# EasyEDA Pro project CanToUart.eprj

# Schematic Schematic1
Board Name: Board1; Create Date: 2025-09-19; Page Name: P1; Project Name: CanToUart; Schematic Name: Schematic1; Update Date: 2025-09-26; Company: 嘉立创EDA; Page Size: A4; Version: V1.0
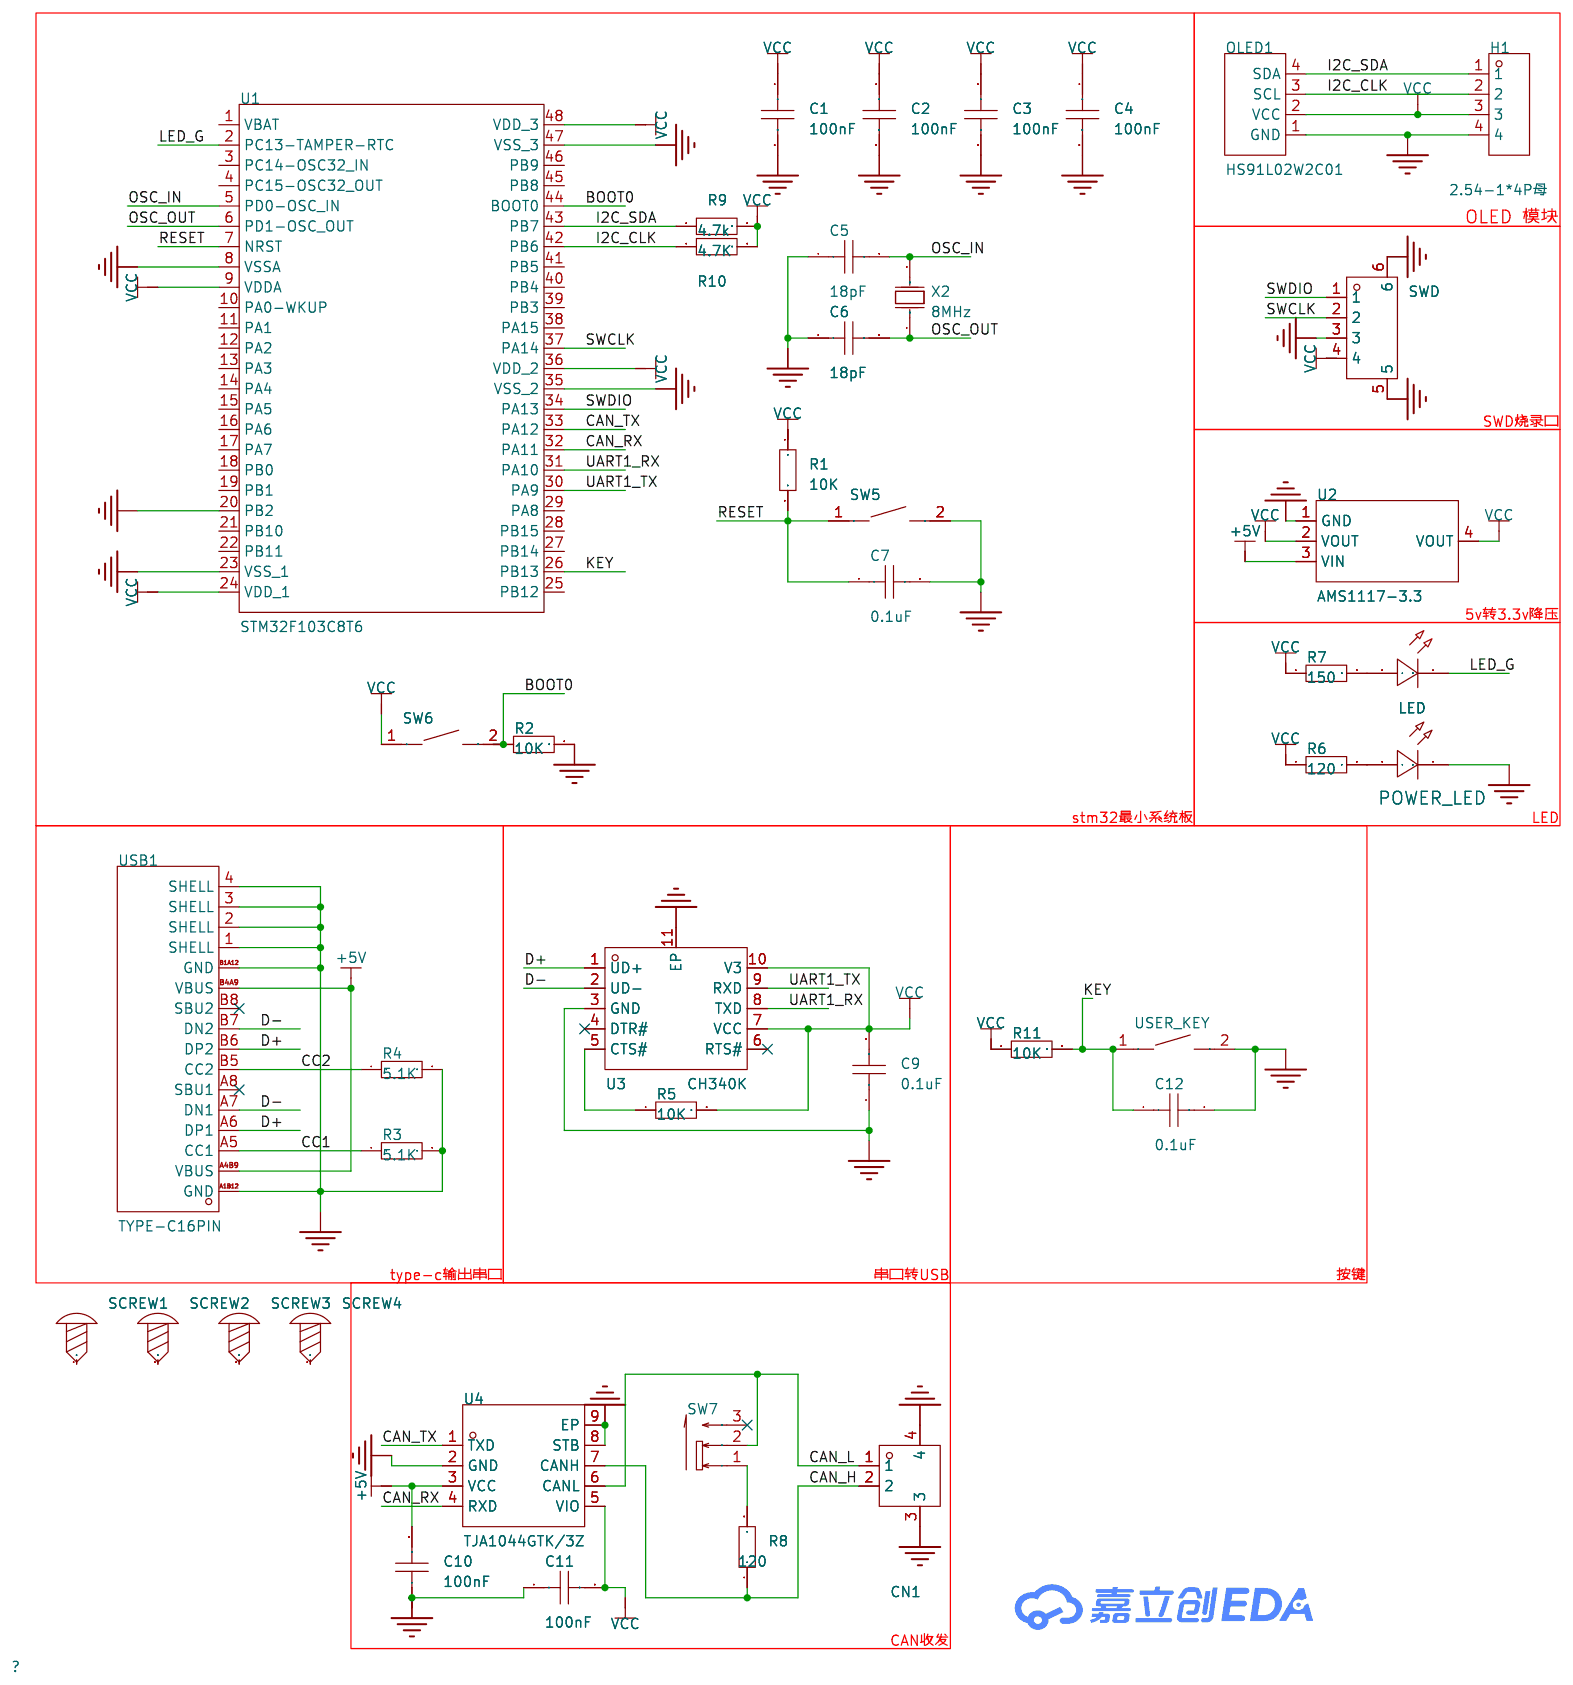
[diagram p0: schematic sheet]

## Parts
C1  100nF  [C0603]
C2  100nF  [C0603]
C3  100nF  [C0603]
C4  100nF  [C0603]
C5  18pF  [C0603]
C6  18pF  [C0603]
C7  0.1uF  [C0603]
C9  0.1uF  [C0603]
C10  100nF  [C0603]
C11  100nF  [C0603]
C12  0.1uF  [C0603]
CN1  WAFER-GH1.25-2PWB  [CONN-TH_2P-P1.25_XUNPU_WAFER-GH1.25-2PWB]
H1  2.54-1*4P母  [HDR-TH_4P-P2.54-V-F]
LED  -  [LED_0603]
OLED1  HS91L02W2C01  [OLED-TH_L38.0-W12.0_HS91L02W2C01]
POWER_LED  -  [LED_0603]
R1  10K  [R0603]
R2  10K  [R0603]
R3  5.1K  [R0603]
R4  5.1K  [R0603]
R5  10K  [R0603]
R6  120  [R0603]
R7  150  [R0603]
R8  120  [R0603]
R9  4.7k  [R0603]
R10  4.7K  [R0603]
R11  10K  [R0603]
SCREW1  -  [M2螺丝]
SCREW2  -  [M2螺丝]
SCREW3  -  [M2螺丝]
SCREW4  -  [M2螺丝]
SW5  TS-1088-AR02016  [SW-SMD_L3.9-W3.0-P4.45]
SW6  TS-1088-AR02016  [SW-SMD_L3.9-W3.0-P4.45]
SW7  MST-22D18G2 3J  [SW-SMD_SHOUHAN_MST-22D18G23J_C2875122]
SWD  532610471  [CONN-SMD_4P-P1.25_53261-0471]
U1  STM32F103C8T6  [LQFP-48_L7.0-W7.0-P0.50-LS9.0-BL]
U2  AMS1117-3.3  [SOT-223-3_L6.5-W3.4-P2.30-LS7.0-BR]
U3  CH340K  [ESOP-10_L4.9-W3.9-P1.00-LS6.2-BL-EP]
U4  TJA1044GTK/3Z  [HVSON-8_L3.0-W3.0-P0.65-BL-EP]
USB1  TYPE-C16PIN  [USB-C-SMD_TYPE-C16PIN]
USER_KEY  TS-1088-AR02016  [SW-SMD_L3.9-W3.0-P4.45]
X2  8MHz  [CRYSTAL-SMD_L5.0-W3.2]

## Library data of the parts
C1-C4 = CGA0603X7R104K500JT: LCSC Part Name: 100nF ±10% 50V; Supplier Part: C6119867; Manufacturer: HRE(芯声); Supplier Footprint: 0603; JLCPCB Part Class: 扩展库; Datasheet: https://atta.szlcsc.com/upload/public/pdf/source/20250103/C44077DA9E7B3EFAE02F22B6D3D1CBC9.pdf; Supplier: LCSC; Tolerance: ±10%; Voltage Rating: 50V; Temperature Coefficient: X7R
C5-C7 C9-C12 = CAP_0603: Supplier Footprint: 0603
CN1 = WAFER-GH1.25-2PWB: LCSC Part Name: 1x2P 间距:1.25mm 卧贴 系列:GH; Supplier Part: C3029377; Manufacturer: XUNPU(讯普); Supplier Footprint: SMD,P=1.25mm,卧贴; JLCPCB Part Class: 扩展库; Datasheet: https://item.szlcsc.com/datasheet/WAFER-GH1.25-2PWB/3561389.html; Supplier: LCSC; Pins Structure: 1x2P; Pitch: 1.25mm; Mounting Type: 卧贴; Reference Series: GH; Number of Pins: 2P; Number of Rows: 1; Number of PINs Per Row: 2; Current Rating: 1A; Contact Material: 黄铜; Contact Plating: 锡; Operating Temperature: -25℃~+85℃; Voltage Rating: 125V; Plastic Material: LCP; Supplementary Features: 辅助焊脚; Color: 米色; Z-Height of the Board: 4.35mm; X-Length of Bottom Edge on Board (Spacing Line): 5.75mm; Y-Width of Bottom Edge on Board: 5mm
H1 = 2.54-1*4P母: LCSC Part Name: 间距:2.54mm 1x4P 直插; Supplier Part: C2718488; Manufacturer: BOOMELE(博穆精密); Supplier Footprint: 插件,P=2.54mm; JLCPCB Part Class: 扩展库; Datasheet: https://item.szlcsc.com/datasheet/2.54-1*4P%25E6%25AF%258D/2834502.html; Supplier: LCSC; Holes Structure: 1x4P; Pitch: 2.54mm; Circular Hole / Square Hole: 方孔; Mounting Type: 直插; Number of Rows: 单排; Number of Positions: 4P; Current Rating: 3A; Holes Direction: 顶部; Contact Material: 青铜; Operating Temperature: -40℃~+105℃
LED = LED_0603-G: Supplier Footprint: 0603
OLED1 = HS91L02W2C01: LCSC Part Name: 0.91寸OLED显示屏白光IIC; Supplier Part: C5248081; Manufacturer: HS(汉昇); JLCPCB Part Class: 扩展库; Datasheet: https://atta.szlcsc.com/upload/public/pdf/source/20230727/C3E43C8E3DDA847F5681FEE7D95C153D.pdf; Supplier: LCSC; Main Control Chip: SSD1306; Interface Type: I2C; Size: 0.91; Pixel Resolution: 128x32; Operating Temperature: -40℃~+70℃
POWER_LED = LED_0603-R: Supplier Footprint: 0603
R1-R11 = Res_0603: Supplier Footprint: 0603
SCREW1-SCREW4 = M2螺丝: Supplier Footprint: 插件
SW5 SW6 USER_KEY = TS-1088-AR02016: LCSC Part Name: 4*3*2mm 立贴 轻触开关; Supplier Part: C720477; Manufacturer: XUNPU(讯普); Supplier Footprint: SMD; JLCPCB Part Class: 基础库; Datasheet: https://item.szlcsc.com/datasheet/TS-1088-AR02016/763484.html; Supplier: LCSC; Circuit: 单刀单掷; Actuator Style: 圆形按钮; Operating Force: 1.6N; Mounting Type: 立贴; Length: 4mm; Width: 3mm; Switch Height: 2mm; with Bracket: 不带支架; Contact Current: 50mA; Voltage Rating: 12V; Actuator/Cap Color: 黑色; Termination Style: SMD接片; Life: 10万次; Operating Temperature: -30℃~+80℃
SW7 = MST-22D18G2 3J: LCSC Part Name: 拨动开关 2档3脚立式贴片 柄高2MM 9.1*3.5*2.0mm; Supplier Part: C2875122; Manufacturer: SHOU HAN(首韩); Supplier Footprint: SMD; JLCPCB Part Class: 扩展库; Supplier: LCSC; Circuit: 单刀双掷; Pin Style: SMD接片; Switch Length: 9.1mm; Switch Width: 3.6mm; Switch Height: 3.45mm; Mounting Style: 立贴; Current Rating (DC): 50mA; Voltage Rating (DC): 12V; Mechanical Life: 1万次; Operating Temperature: -30℃~+80℃
SWD = 532610471: LCSC Part Name: 1x4P 间距:1.25mm 卧贴 系列:PicoBlade(MX 1.25); Supplier Part: C240847; Manufacturer: MOLEX; Supplier Footprint: SMD,P=1.25mm,卧贴; JLCPCB Part Class: 扩展库; Datasheet: https://www.molex.com/content/dam/molex/molex-dot-com/products/automated/en-us/salesdrawingpdf/532/53261/532610471_sd.pdf?inline; Supplier: LCSC; Pins Structure: 1x4P; Pitch: 1.25mm; Mounting Type: 卧贴; Reference Series: PicoBlade(MX 1.25); Number of Pins: 4P; Number of Rows: 1; Number of PINs Per Row: 4; Current Rating: 1A; Contact Material: 磷青铜; Contact Plating: 锡; Operating Temperature: -40℃~+105℃; Voltage Rating: 125V; Plastic Material: 玻纤增强PA; Flame Retardant Rating: UL94V-0; Supplementary Features: 辅助焊脚; Color: 白色; Z-Height of the Board: 3.4mm; X-Length of Bottom Edge on Board (Spacing Line): 10.15mm; Y-Width of Bottom Edge on Board: 5.2mm
U1 = STM32F103C8T6: LCSC Part Name: 主流增强型ARM Cortex-M3 MCU，具有64 KB Flash、72 MHz CPU、电机控制、USB和CAN; Supplier Part: C8734; Manufacturer: ST(意法半导体); Supplier Footprint: LQFP-48(7x7); JLCPCB Part Class: 扩展库; Datasheet: https://item.szlcsc.com/datasheet/STM32F103C8T6/9243.html; Supplier: LCSC; CPU Core: ARM-M3; CPU Maximum Speed: 72MHz; Program Storage Size: 64KB; Program Memory Type: FLASH; Number of I/O: 37; ADC (Bit): 12bit; Voltage - Supply: 2V~3.6V
U2 = AMS1117-3.3_C6186: LCSC Part Name: 输出3.3V 1A; Supplier Part: C6186; Manufacturer: AMS; Supplier Footprint: SOT-223; JLCPCB Part Class: 基础库; Datasheet: https://item.szlcsc.com/datasheet/AMS1117-3.3/6652.html; Supplier: LCSC; Output Type: 固定; Voltage - Supply: 16V; Output Voltage: 3.3V; Output Current: 1A; Power Supply Rejection Ratio (PSRR): 72dB@(120Hz); Voltage Dropout: 1.1V@(800mA); standby current: 5mA; Features: 过流保护；过热保护; Operating Temperature: -40℃~+125℃; Output Configuration: 正极; Number of Outputs: 1
U3 = CH340K: LCSC Part Name: USB转串口芯片CH340; Supplier Part: C968586; Manufacturer: WCH(南京沁恒); Supplier Footprint: ESSOP-10-150mil-1mm; JLCPCB Part Class: 扩展库; Datasheet: https://atta.szlcsc.com/upload/public/pdf/source/20240313/C21A12AB66F63ABF8F8743FF13A35C95.pdf; Supplier: LCSC; Applications Function: USB转串口; Protocol: USB 2.0; Voltage - Supply: 3.3V；5V; Data Rate: 2Mbps; Operating Temperature: -20℃~+70℃
U4 = TJA1044GTK/3Z: Supplier Part: C2157795; Manufacturer: NXP(恩智浦); Supplier Footprint: HVSON-8-EP(3x3); JLCPCB Part Class: 扩展库; Datasheet: https://www.nxp.com/docs/en/data-sheet/TJA1044.pdf; Supplier: LCSC; Type: CAN收发器; Data Rate: 5Mbps; Voltage - Supply: 4.75V~5.25V; Current - Supply: 70mA; Operating Temperature: -40℃~+150℃
USB1 = TYPE-C16PIN: LCSC Part Name: Type-C 母 卧贴; Supplier Part: C393939; Manufacturer: SHOU HAN(首韩); Supplier Footprint: SMD; JLCPCB Part Class: 扩展库; Datasheet: https://item.szlcsc.com/datasheet/TYPE-C16PIN/372551.html; Supplier: LCSC; Connector Type: Type-C; Protocol Standard: USB 3.1; Gender: 母; Mounting Type: 卧贴; Number of Contacts: 16P; Number of Ports: 1; Current Rating-Power: 3A; Voltage Rating: 30V; Connect-Disconnect Life: 1万次; Detection color: 黑色; Operating Temperature: -40℃~+85℃
X2 = X50328MSB2GI: LCSC Part Name: YSX530GA 8MHZ 2P 5032 20PF ±10PPM -40~85℃ (±20PPM); Supplier Part: C115962; Manufacturer: YXC(扬兴晶振); Supplier Footprint: SMD5032-2P; JLCPCB Part Class: 基础库; Datasheet: https://item.szlcsc.com/datasheet/X50328MSB2GI/117214.html; Supplier: LCSC; Type: 贴片晶振; Normal temperature Frequency Tolerance: ±10ppm; Load Capacitance: 20pF; Frequency Stability: ±20ppm; Operating Temperature: -40℃~+85℃

## Nets
+5V: C10.2 U2.3(VIN) U4.3(VCC) USB1.A4B9(VBUS) USB1.B4A9(VBUS)
GND: C1.2 C2.2 C3.2 C4.2 C5.1 C6.1 C7.2 C9.1 C10.1 C11.1 C12.2 CN1.3 CN1.4 H1.4 OLED1.1(GND) POWER_LED.1(C) R2.2 R3.2 R4.2 SW5.2 SWD.3 SWD.5 SWD.6 U1.8(VSSA) U1.20(PB2) U1.23(VSS_1) U1.35(VSS_2) U1.47(VSS_3) U2.1(GND) U3.3(GND) U3.11(EP) U4.2(GND) U4.8(STB) U4.9(EP) USB1.1(SHELL) USB1.2(SHELL) USB1.3(SHELL) USB1.4(SHELL) USB1.A1B12(GND) USB1.B1A12(GND) USER_KEY.2
VCC: C1.1 C2.1 C3.1 C4.1 C9.2 C11.2 H1.3 OLED1.2(VCC) R1.1 R5.2 R6.1 R7.1 R9.2 R10.2 R11.1 SW6.1 SWD.4 U1.9(VDDA) U1.24(VDD_1) U1.36(VDD_2) U1.48(VDD_3) U2.2(VOUT) U2.4(VOUT) U3.7(VCC) U3.10(V3) U4.5(VIO)
BOOT0: R2.1 SW6.2 U1.44(BOOT0)
CAN_H: CN1.2 R8.1 U4.7(CANH)
CAN_L: CN1.1 SW7.2 U4.6(CANL)
CAN_RX: U1.32(PA11) U4.4(RXD)
CAN_TX: U1.33(PA12) U4.1(TXD)
CC1: R3.1 USB1.A5(CC1)
CC2: R4.1 USB1.B5(CC2)
D+: U3.1(UD+) USB1.A6(DP1) USB1.B6(DP2)
D-: U3.2(UD-) USB1.A7(DN1) USB1.B7(DN2)
I2C_CLK: H1.2 OLED1.3(SCL) R10.1 U1.42(PB6)
I2C_SDA: H1.1 OLED1.4(SDA) R9.1 U1.43(PB7)
KEY: C12.1 R11.2 U1.26(PB13) USER_KEY.1
LED_G: LED.1(C) U1.2(PC13-TAMPER-RTC)
OSC_IN: C5.2 U1.5(PD0-OSC_IN) X2.2(OSC2)
OSC_OUT: C6.2 U1.6(PD1-OSC_OUT) X2.1(OSC1)
RESET: C7.1 R1.2 SW5.1 U1.7(NRST)
SWCLK: SWD.2 U1.37(PA14)
SWDIO: SWD.1 U1.34(PA13)
UART1_RX: U1.31(PA10) U3.8(TXD)
UART1_TX: U1.30(PA9) U3.9(RXD)
$1N4391: R5.1 U3.5(CTS#)
$1N4645: POWER_LED.2(A) R6.2
$1N4695: LED.2(A) R7.2
$1N5635: R8.2 SW7.1

Not connected (* = marked no-connect by the designer): SCREW1 1; SCREW2 1; SCREW3 1; SCREW4 1; SW7 3*; U1 1(VBAT) 3(PC14-OSC32_IN) 4(PC15-OSC32_OUT) 10(PA0-WKUP) 11(PA1) 12(PA2) 13(PA3) 14(PA4) 15(PA5) 16(PA6) 17(PA7) 18(PB0) 19(PB1) 21(PB10) 22(PB11) 25(PB12) 27(PB14) 28(PB15) 29(PA8) 38(PA15) 39(PB3) 40(PB4) 41(PB5) 45(PB8) 46(PB9); U3 4(DTR#)* 6(RTS#)*; USB1 A8(SBU1)* B8(SBU2)*

## Notes on the sheet
- OLED 模块
- SWD烧录口
- 5v转3.3v降压
- stm32最小系统板
- LED
- type-c输出串口
- 串口转USB
- 按键
- CAN收发

# Board V0.1
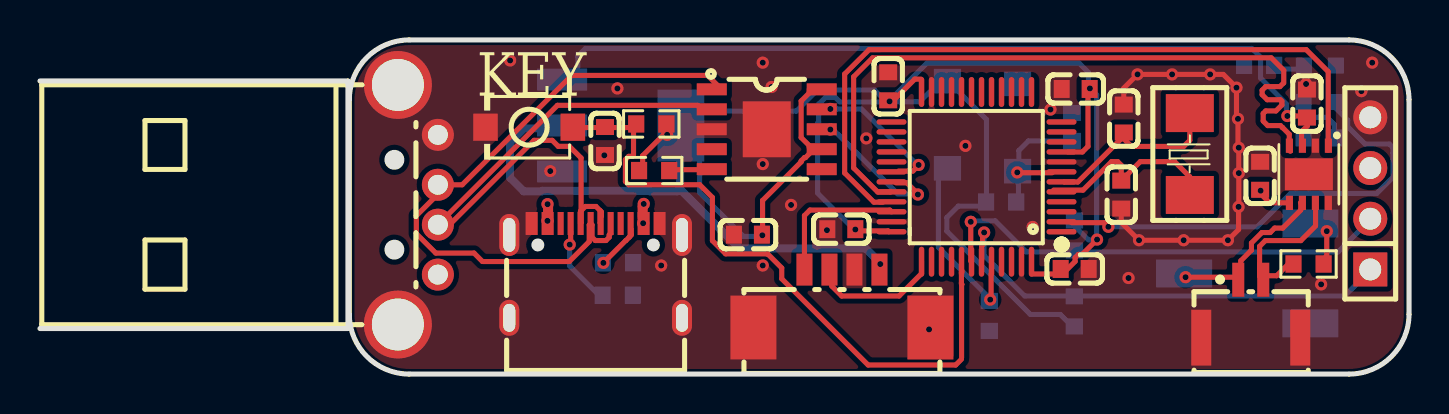
[diagram p1: board, top side]
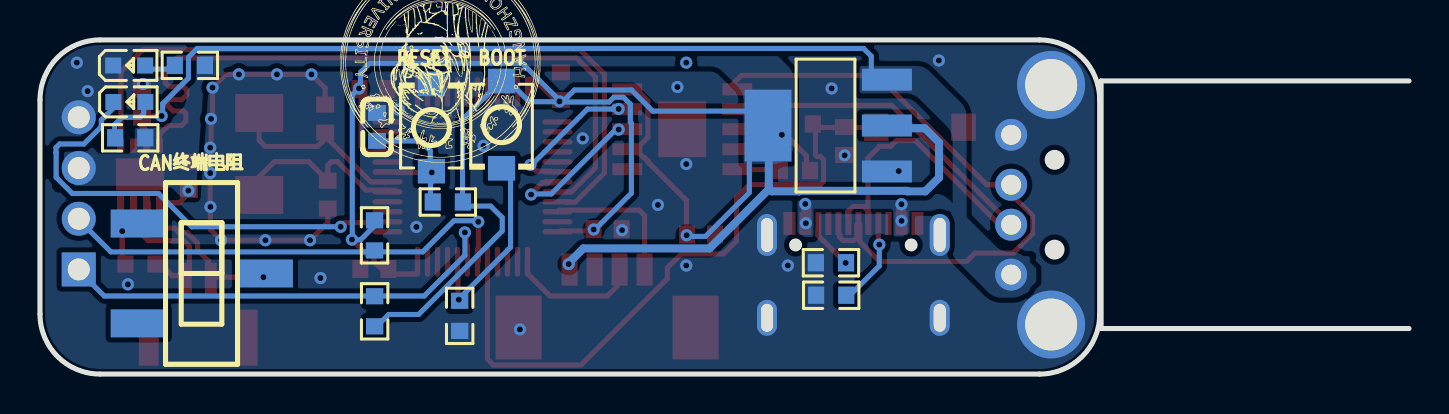
[diagram p2: board, bottom side, seen from below]

Outline 68.47 x 16.74 mm; copper layers: Top Layer, Bottom Layer. Coordinates in mm from the lower left corner of the outline.
Outline path: 15.47,13.74 15.47,3 arc(16.35,0.88) 18.47,0 65.47,0 arc(67.59,0.88) 68.47,3 68.47,13.74 arc(67.59,15.86) 65.47,16.74 18.47,16.74 arc(16.35,15.86) 15.47,13.74
Stack: Top Layer 0.035mm / Dielectric1 1.51mm FR4 er 4.5 / Bottom Layer 0.035mm

## Design rules (mm)
net OSC_IN: DP1
net OSC_OUT: DP1
net CAN_H: DP2
net CAN_L: DP2
net I2C_SDA: DP4
net I2C_CLK: DP4
net CAN_RX: DP3
net CAN_TX: DP3
net D+: DP5
net D-: DP5
template: 自定义配置
spacing copperThickness1oz (default): track to track 0.102, other pairs 0.152 to 0.3
spacing copperThickness2oz: track to track 0.203, other pairs 0.152 to 0.3
track width copperThickness1oz (default): min 0.127, default 0.254, max 2.54
track width copperThickness2oz: min 0.203, default 0.254, max 2.54
differential pair differentialPair (default): width min 0.127, default 0.254, max 2.54; gap min 0.152, default 0.152
via viaSize (default): diameter min 0.5, default 0.61, max 10; hole min 0.3, default 0.305, max 6.3

## Placement (name value [footprint] x y rotation side)
C1  100nF  [C0603]  51.8 14.28 180 top
C2  100nF  [C0603]  42.42 14.41 90 top
C3  100nF  [C0603]  51.75 5.27 0 top
C4  100nF  [C0603]  40.08 7.26 180 top
C5  18pF  [C0603]  54.08 8.99 90 top
C6  18pF  [C0603]  54.21 12.8 270 top
C7  0.1uF  [C0603]  51.62 12.38 90 bottom
C9  0.1uF  [C0603]  35.41 6.98 0 top
C10  100nF  [C0603]  63.37 13.55 270 top
C11  100nF  [C0603]  61.02 9.93 270 top
C12  0.1uF  [C0603]  28.26 11.67 270 top
CN1  WAFER-GH1.25-2PWB  [CONN-TH_2P-P1.25_XUNPU_WAFER-GH1.25-2PWB]  60.56 3.27 0 top
H1  2.54-1*4P母  [HDR-TH_4P-P2.54-V-F]  66.53 9.05 90 top
LED  -  [LED_0603]  63.95 13.64 180 bottom
POWER_LED  -  [LED_0603]  63.96 15.46 180 bottom
R1  10K  [R0603]  48.07 8.62 0 bottom
R2  10K  [R0603]  47.48 2.92 270 bottom
R3  5.1K  [R0603]  28.9 3.95 0 bottom
R4  5.1K  [R0603]  28.91 5.58 0 bottom
R5  10K  [R0603]  30.72 10.19 180 top
R6  120  [R0603]  60.97 15.46 0 bottom
R7  150  [R0603]  63.96 11.83 0 bottom
R8  120  [R0603]  63.45 5.51 0 top
R9  4.7k  [R0603]  51.73 3.14 270 bottom
R10  4.7K  [R0603]  51.74 6.95 90 bottom
R11  10K  [R0603]  30.57 12.53 180 top
SW5  TS-1088-AR02016  [SW-SMD_L3.9-W3.0-P4.45]  48.89 12.35 90 bottom
SW6  TS-1088-AR02016  [SW-SMD_L3.9-W3.0-P4.45]  45.39 12.49 270 bottom
SW7  MST-22D18G2 3J  [SW-SMD_SHOUHAN_MST-22D18G23J_C2875122]  60.38 5.04 270 bottom
SWD  532610471  [CONN-SMD_4P-P1.25_53261-0471]  40.11 3.78 0 top
U1  STM32F103C8T6  [LQFP-48_L7.0-W7.0-P0.50-LS9.0-BL]  46.84 9.88 90 top
U2  AMS1117-3.3  [SOT-223-3_L6.5-W3.4-P2.30-LS7.0-BR]  29.08 12.45 180 bottom
U3  CH340K  [ESOP-10_L4.9-W3.9-P1.00-LS6.2-BL-EP]  36.35 12.26 270 top
U4  TJA1044GTK/3Z  [HVSON-8_L3.0-W3.0-P0.65-BL-EP]  63.46 10.01 180 top
USB1  TYPE-C16PIN  [USB-C-SMD_TYPE-C16PIN]  27.79 5.18 0 top
USB2  AM90  [USB-AM-TH_AM90]  18.9 8.48 270 top
USER_KEY  TS-1088-AR02016  [SW-SMD_L3.9-W3.0-P4.45]  24.47 12.36 180 top
X2  8MHz  [CRYSTAL-SMD_L5.0-W3.2]  57.51 11.02 270 top

## Footprints (pads in the part's own frame, mm; a bottom-side part is the same pattern mirrored in y, then rotated)
C0603
  rect 0.8x0.9 smd: 1(-0.7,0) 2(0.7,0)
CONN-SMD_4P-P1.25_53261-0471
  rect 0.8x1.6 smd: 1(-1.875,1.45) 2(-0.625,1.45) 3(0.625,1.45) 4(1.875,1.45)
  rect 2.3x3.2 smd: 5(4.425,-1.45) 6(-4.425,-1.45)
CONN-TH_2P-P1.25_XUNPU_WAFER-GH1.25-2PWB
  rect 0.6x1.7 smd: 1(-0.625,1.45) 2(0.625,1.45)
  rect 1x2.8 smd: 3(-2.475,-1.45) 4(2.475,-1.45)
CRYSTAL-SMD_L5.0-W3.2
  rect 1.9x2.4 smd: 1(-2.05,0) 2(2.05,0)
ESOP-10_L4.9-W3.9-P1.00-LS6.2-BL-EP
  rect 0.6x1.5 smd: 1(-2,-2.75) 2(-1,-2.75) 3(0,-2.75) 4(1,-2.75) 5(2,-2.75) 6(2,2.75) 7(1,2.75) 8(0,2.75) 9(-1,2.75) 10(-2,2.75)
  rect 2.8x2.4 smd: 11(0,0)
HDR-TH_4P-P2.54-V-F
  rect 1.7x1.7 hole 1.1: 1(-3.81,0)
  round 1.7 hole 1.1: 2(-1.27,0) 3(1.27,0) 4(3.81,0)
HVSON-8_L3.0-W3.0-P0.65-BL-EP
  rect 0.355x0.711 smd: 1(-0.975,-1.433) 2(-0.325,-1.433) 3(0.325,-1.433) 4(0.975,-1.433) 5(0.975,1.433) 6(0.325,1.433) 7(-0.325,1.433) 8(-0.975,1.433)
  rect 2.4x1.6 smd: 9(0,0)
LED_0603
  rect 0.8x0.8 smd: 1(-0.851,-0.01) 2(0.75,-0.005)
LQFP-48_L7.0-W7.0-P0.50-LS9.0-BL
  oval 0.27x1.5 smd: 1(-2.75,-4.25) 2(-2.25,-4.25) 3(-1.75,-4.25) 4(-1.25,-4.25) 5(-0.75,-4.25) 6(-0.25,-4.25) 7(0.25,-4.25) 8(0.75,-4.25) 9(1.25,-4.25) 10(1.75,-4.25) 11(2.25,-4.25) 12(2.75,-4.25) 25(2.75,4.25) 26(2.25,4.25) 27(1.75,4.25) 28(1.25,4.25) 29(0.75,4.25) 30(0.25,4.25) 31(-0.25,4.25) 32(-0.75,4.25) 33(-1.25,4.25) 34(-1.75,4.25) 35(-2.25,4.25) 36(-2.75,4.25)
  oval 1.5x0.27 smd: 13(4.25,-2.75) 14(4.25,-2.25) 15(4.25,-1.75) 16(4.25,-1.25) 17(4.25,-0.75) 18(4.25,-0.25) 19(4.25,0.25) 20(4.25,0.75) 21(4.25,1.25) 22(4.25,1.75) 23(4.25,2.25) 24(4.25,2.75) 37(-4.25,2.75) 38(-4.25,2.25) 39(-4.25,1.75) 40(-4.25,1.25) 41(-4.25,0.75) 42(-4.25,0.25) 43(-4.25,-0.25) 44(-4.25,-0.75) 45(-4.25,-1.25) 46(-4.25,-1.75) 47(-4.25,-2.25) 48(-4.25,-2.75)
R0603
  rect 0.806x0.864 smd: 1(-0.753,0) 2(0.753,0)
SOT-223-3_L6.5-W3.4-P2.30-LS7.0-BR
  rect 2.5x1.1 smd: 1(2.97,-2.3) 2(2.97,0) 3(2.97,2.3)
  rect 2.34x3.6 smd: 4(-2.97,0)
SW-SMD_L3.9-W3.0-P4.45
  rect 1.23x1.36 smd: 1(-2.185,0) 2(2.185,0)
SW-SMD_SHOUHAN_MST-22D18G23J_C2875122
  rect 1.4x2.8 smd: 1(-2.5,-3.155) 2(0,3.155) 3(2.5,-3.155)
USB-AM-TH_AM90
  round 1.6 hole 1: 1(3.5,1) 2(1,1) 3(-1,1) 4(-3.5,1)
  round 3.4 hole 2.6: MH1(6,-1) MH2(-6,-1)
USB-C-SMD_TYPE-C16PIN
  oval 1x2.1 hole 0.6x1.7: 1(-4.32,1.788) 2(4.32,1.788)
  oval 1x1.8 hole 0.6x1.4: 3(-4.32,-2.362) 4(4.32,-2.362)
  rect 0.6x1.15 smd: A1B12(-3.2,2.362) A4B9(-2.4,2.362) B1A12(3.2,2.362) B4A9(2.4,2.362)
  rect 0.3x1.15 smd: A5(-1.25,2.362) A6(-0.25,2.362) A7(0.25,2.362) A8(1.25,2.362) B5(1.75,2.362) B6(0.75,2.362) B7(-0.75,2.362) B8(-1.75,2.362)

## Nets
+5V: C10.2 U2.3 U4.3 USB1.A4B9 USB1.B4A9 USB2.1
GND: C1.2 C2.2 C3.2 C4.2 C5.1 C6.1 C7.2 C9.1 C10.1 C11.1 C12.2 CN1.3 CN1.4 H1.4 POWER_LED.1 R2.2 R3.2 R4.2 SW5.2 SWD.3 SWD.5 SWD.6 U1.8 U1.23 U1.35 U1.47 U2.1 U3.3 U3.11 U4.2 U4.8 U4.9 USB1.1 USB1.2 USB1.3 USB1.4 USB1.A1B12 USB1.B1A12 USB2.4 USB2.MH1 USB2.MH2 USER_KEY.2
VCC: C1.1 C2.1 C3.1 C4.1 C9.2 C11.2 H1.3 R1.1 R5.2 R6.1 R7.1 R9.2 R10.2 R11.1 SW6.1 SWD.4 U1.9 U1.24 U1.36 U1.48 U2.2 U2.4 U3.7 U3.10 U4.5
BOOT0: R2.1 SW6.2 U1.44
CAN_H: CN1.2 R8.1 U4.7
CAN_L: CN1.1 SW7.2 U4.6
CAN_RX: U1.32 U4.4
CAN_TX: U1.33 U4.1
D+: U3.1 USB1.A6 USB1.B6 USB2.3
D-: U3.2 USB1.A7 USB1.B7 USB2.2
I2C_CLK: H1.2 R10.1 U1.42
I2C_SDA: H1.1 R9.1 U1.43
KEY: C12.1 R11.2 U1.41 USER_KEY.1
LED_G: LED.1 U1.2
OSC_IN: C5.2 U1.5 X2.2
OSC_OUT: C6.2 U1.6 X2.1
RESET: C7.1 R1.2 SW5.1 U1.7
SWCLK: SWD.2 U1.37
SWDIO: SWD.1 U1.34
UART1_RX: U1.31 U3.8
UART1_TX: U1.30 U3.9
$1N4083: R3.1 USB1.A5
$1N4139: R4.1 USB1.B5
$1N4391: R5.1 U3.5
$1N4645: POWER_LED.2 R6.2
$1N4695: LED.2 R7.2
$1N5635: R8.2 SW7.1

Pads without a net: SW7 3; U1 1 3 4 10 11 12 13 14 15 16 17 18 19 20 21 22 25 26 27 28 29 38 39 40 45 46; U3 4 6; USB1 A8 B8

## Via types
v1: diameter 0.61, hole 0.305, Top Layer to Bottom Layer, 58 vias

## Routing (per net, layer and track width the routed paths; a pad name or vN(x,y) marks a point on that pad's centre or on a via; arc(x,y) is an arc through that point)
+5V: length 42.5
  Top Layer w0.254: 63.12,11.55 63.1,11.58 63.1,12.14 63.39,12.44 63.39,12.67 ; v1(62.39,12.93) 63.03,12.93 63.12,12.84
  Top Layer w0.5: 25.41,8.46 25.41,7.71 v1(25.38,7.68) ; 30.14,7.85 30.14,8.39 30.2,8.44
  Bottom Layer w0.254: 62.34,12.98 62.34,13.54 61.05,14.83 61.05,15.87 60.6,16.31 27.28,16.31 26.89,15.92 26.89,14.76
  vias: v1(25.38,8.51) v1(30.2,8.52) v1(30.17,7.56)
GND: length 21.3
  Top Layer w0.254: C6.1 54.21,14.32 v1(54.89,15.01) v1(56.62,15.01) v1(58.52,15.01) 59.18,15.01 v1(59.84,14.35) 59.84,12.86 v1(59.92,12.78) 59.92,11.38 v1(59.96,11.34) 59.96,10.07 v1(59.96,10.07) 59.96,8.39 v1(59.95,8.38) 59.95,7.24 v1(59.41,6.7) v1(57.2,6.7) v1(54.97,6.7) 54.08,7.59 C5.1
  vias: v1(23.51,15.71) v1(25.52,10.17) v1(28.22,10.96) v1(28.88,14.31) v1(31.07,5.44) v1(36.15,15.6) v1(36.15,10.52) v1(36.15,5.44) v1(36.59,14.38) v1(37.56,8.47) v1(39.36,7.21) v1(41.33,11.8) v1(44.47,2.24) v1(46.28,11.43) v1(49.65,7.37) v1(50.54,13.25) v1(54.44,4.81) v1(63.32,14.53) v1(64.08,4.49) v1(66.09,14.17) v1(66.63,15.6)
VCC: length 122.7
  Top Layer w0.254: 41.08,7.17 42.41,7.17 42.46,7.13 ; 38.63,11.19 38.64,11.18 ; 38.63,11.19 38.48,11.34 38.48,11.44 38.07,11.85 38.07,13.68 38.48,14.08 38.48,14.27 ; 38.63,11.19 38.28,10.84 38.23,10.84 38.07,10.68 38.07,10.63 36.14,8.7 36.14,6.98 ; 52.41,14.17 52.41,11.4 52.14,11.12 51.41,11.12 ; 44.06,14.77 43.75,14.77 42.58,13.6 ; 31.26,12.15 31.33,12.23 31.33,12.63 ; v1(52.87,6.74) 52.12,5.99 51.93,5.99 51.77,5.83 51.77,5.64 51.14,5.01 49.61,5.01 ; 30.14,10.05 30.14,10.94 31.28,12.07 ; 62.52,8.58 61.5,8.58 61.04,9.05
  Bottom Layer w0.254: 47.24,8.66 46.98,8.41 45.93,8.41 45.35,7.84 45.35,7.17 49.53,2.99 51.03,2.99 51.77,2.25 ; 36.12,6.9 35.19,6.9 32.99,9.09 32.99,11.35 ; 40.69,7.26 38.89,9.06 38.89,12.56 38.95,12.61 38.95,13.52 39.29,13.86 39.77,13.86 40.01,13.63 42.29,13.63 ; 52.85,6.88 52.85,13.99 52.55,14.29 ; 51.79,7.58 51.79,7.37 52.44,6.73 52.83,6.73 ; 45.25,14.89 44,13.64 42.53,13.64 ; 52.44,14.29 52.44,15.11 51.98,15.57 44.35,15.57 42.5,13.71 ; 47.34,8.76 47.34,12.75 45.3,14.79 ; 42.31,13.65 41.74,14.23 38.88,14.23 37.82,13.17 32.35,13.17
  Bottom Layer w0.4: 32,9.23 31.94,9.23 31.87,9.15 30.5,9.15 30.47,9.18 25.13,9.18 25.1,9.15 24.19,9.15 23.51,9.84 23.51,11.6 24.22,12.31 26.62,12.31 26.68,12.25 ; 42.12,5.47 41.29,6.3 34.98,6.3 32.02,9.25 32.02,11.64
  vias: v1(31.37,11.98) v1(36.13,6.95) v1(40.78,7.24) v1(42.03,5.51) v1(42.49,13.66) v1(52.51,14.31) v1(61.05,9.19)
BOOT0: length 8.5
  Top Layer w0.254: 47.57,4.99 47.57,3.77 v1(47.52,3.73)
  Bottom Layer w0.254: 47.48,3.81 44.93,6.35 44.93,10.02
CAN_H: length 7.7
  Top Layer w0.254: 63.79,8.77 63.8,8.76 63.8,7.42 63.06,6.68 61.28,6.68 61,6.4 61,4.91 CN1.2 ; 61.29,4.92 61.85,4.92 62.44,5.51
CAN_L: length 8.3
  Top Layer w0.254: 59.88,4.76 59.79,4.85 v1(57.3,4.85) ; 63.04,8.58 63.06,8.57 63.06,8.21 62.16,7.31 61.75,7.31 61.53,7.09 61.12,7.09 60.59,6.57 60.59,6.21 60.06,5.67 60.06,4.85 CN1.1
CAN_RX: length 36.4
  Top Layer w0.254: 62.19,14.58 62.01,14.4 61.31,14.4 61.13,14.22 61.13,14 61.38,13.74 62.04,13.74 62.11,13.67 62.11,13.48 61.82,13.18 61.31,13.18 61.18,13.05 61.18,12.67 61.41,12.45 62.04,12.45 62.15,12.34 62.15,12.34 62.48,12.01 62.48,11.21 62.54,11.16 ; 62.21,14.58 62.21,15.21 61.58,15.84 41.64,15.84 40.69,14.89 40.69,10.32 41.9,9.12 42.52,9.12 42.56,9.15
CAN_TX: length 36.6
  Top Layer w0.254: 64.43,11.21 64.43,15.15 63.33,16.25 41.46,16.25 40.25,15.03 40.25,10.07 41.71,8.61 42.16,8.61
D+: length 32.5
  Top Layer w0.254: 34.18,14.16 33.39,14.96 26.59,14.96 21.12,9.48 USB2.3 ; 28.55,7.05 28.47,6.97 28.47,6.85 28.31,6.69 27.77,6.69 27.61,6.85 27.61,7.47 USB1.A6 27.47,7.47 27.47,6.63 26.47,5.64 22.13,5.64 21.71,6.06 19.8,6.06 18.82,7.03 18.82,7.93 20.11,9.21 20.46,9.21
D-: length 32.1
  Top Layer w0.254: 28.02,8.18 28.08,8.12 28.08,7.91 28.04,7.87 ; 28.02,8.18 27.81,8.4 27.27,8.4 27.06,8.18 ; 28.02,8.18 28.02,7.56 USB1.A7 ; 20.05,7.47 20.12,7.54 20.55,7.54 24.71,11.71 25.62,11.71 25.92,11.41 26.48,11.41 27.06,10.82 27.06,8.18 ; 34.18,13.16 33.18,13.16 32.88,13.46 25.88,13.46 USB2.2 ; 27.06,8.18 27.03,8.15 27.03,7.55 ; 27.06,8.18 27.06,7.58 27.03,7.55 ; 27.03,7.55 USB1.B7
I2C_CLK: length 22.8
  Top Layer w0.254: U1.42 46.55,5.67 v1(46.55,7.63)
  Bottom Layer w0.254: v1(46.55,7.63) 46.6,7.68 47.77,7.68 49.33,6.12 64.93,6.12 66.14,7.34
I2C_SDA: length 22.8
  Top Layer w0.254: v1(47.22,7.09) 47.14,7.01 47.14,6.48 47.09,6.43 47.09,5.73 47.09,5.73 U1.43
  Bottom Layer w0.254: v1(47.22,7.09) 47.22,5.94 49.25,3.91 65.25,3.91 66.14,4.8
KEY: length 33
  Top Layer w0.254: 36.39,6.02 37.1,5.31 37.1,4.77 41.42,0.45 45.8,0.45 46.09,0.74 ; 36.39,6.02 36.37,6.01 ; 36.39,6.02 34.29,6.02 33.63,6.68 33.63,8.85 32.99,9.48 29.44,9.48 29.28,9.65 29.28,10.74 29.44,10.91 29.6,10.91 29.69,10.99 29.69,12.79 ; 46.09,4.57 46.1,4.49 ; 46.09,4.57 46.09,5.1 46.12,5.13 ; 46.09,4.57 46.09,4.51 46.1,4.49 ; 46.1,4.49 46.09,4.48 46.09,0.83 ; 26.84,12.35 29.66,12.35
LED_G: length 22.6
  Top Layer w0.254: 51.6,7.58 53.23,7.58 v1(53.43,7.38)
  Bottom Layer w0.254: 64.76,13.37 65.4,12.72 65.4,12.39 66.27,11.52 67.49,11.52 67.67,11.34 67.67,11.09 67.66,11.08 67.66,9.85 66.85,9.05 62.55,9.05 60.88,7.38 v1(53.43,7.38)
OSC_IN: length 9.9
  Top Layer w0.254: X2.2 57.51,9.88 56.75,10.64 55.03,10.64 C5.2 54.08,10.46 53.9,10.64 53.59,10.64 52.17,9.21 50.7,9.21
OSC_OUT: length 9.2
  Top Layer w0.254: X2.1 57.51,11.71 57.2,11.4 54.59,11.4 54.21,11.78 ; 51.22,9.63 51.22,9.62 51.91,9.62 54.07,11.78 54.21,11.78 ; 54.21,11.78 C6.2
RESET: length 6.2
  Top Layer w0.254: 50.63,10.09 48.89,10.09 v1(48.88,10.1)
  Bottom Layer w0.254: 51.39,11.68 49.44,11.68 48.96,11.19 48.96,10.57 ; 48.94,8.47 48.94,9.54 48.89,9.59
SWCLK: length 6.6
  Top Layer w0.254: U1.37 44.09,5.03 42.97,3.91 40.1,3.91 39.6,4.41 39.6,5.12 SWD.2
SWDIO: length 7.2
  Top Layer w0.254: U1.34 42.5,8.21 38.51,8.21 38.23,7.94 SWD.1
UART1_RX: length 6.9
  Top Layer w0.254: 43.93,9.01 43.36,9.58 42.81,9.58
  Bottom Layer w0.254: 43.87,9.02 42.9,9.02 39.67,12.25
  vias: v1(39.53,12.25) v1(43.91,8.99)
UART1_TX: length 6.6
  Top Layer w0.254: 43.91,10.42 43.66,10.17 42.95,10.17
  Bottom Layer w0.254: 39.59,13.38 39.75,13.38 39.86,13.27 41.09,13.27 43.9,10.47
  vias: v1(39.53,13.28) v1(43.94,10.47)
$1N4083: length 3.7
  Top Layer w0.254: 26.54,7.16 26.54,6.53 v1(26.49,6.48)
  Bottom Layer w0.254: v1(26.49,6.48) 26.49,5.42 27.89,4.02
$1N4139: length 2.3
  Top Layer w0.254: 29.57,7.25 29.57,6.96 29.47,6.86 29.47,6.85 29.31,6.69 29.3,6.69 v1(28.18,5.57)
$1N4391: length 1.7
  Top Layer w0.254: 31.65,10.24 33.33,10.24 33.36,10.22
$1N4645: length 1.6
  Bottom Layer w0.254: 63.27,15.27 61.97,15.27 61.8,15.45
$1N4695: length 3
  Bottom Layer w0.254: 64.74,12.01 64.74,12.49 64.37,12.86 63.47,12.86 63.29,13.04 63.29,13.54 63.03,13.8
$1N5635: length 2.9
  Top Layer w0.254: 63.95,5.51 64.36,5.92 v1(64.36,7.16)
  Bottom Layer w0.254: 63.45,7.52 64,7.52 v1(64.36,7.16)

## Copper pours and planes (outline as drawn; the poured copper is in the pictures)
+5V on Bottom Layer: 30.58,8.99 30.59,8.99 24.8,8.99 24.77,9.03 23.71,9.03 23.33,8.95 23,8.74 20.68,6.41 20.35,6.19 19.97,6.12 19.88,6.12 19.5,6.04 19.18,5.83 18.65,5.29 18.65,4.61 19.14,4.12 19.47,3.9 19.85,3.82 20.36,3.82 20.74,3.9 21.06,4.12 22.6,5.66 22.82,5.98 22.89,6.36 22.89,8.08 22.99,8.18 24.98,8.18 24.98,6.98 25.07,6.89 25.72,6.89 25.79,6.96 25.79,8.17 25.9,8.28 29.77,8.28 29.78,8.29 29.78,6.91 29.82,6.86 30.55,6.86 30.58,6.89
+5V on Bottom Layer: 27.48,15.45 27.48,14.06 25.17,14.06 24.79,13.98 24.47,13.77 23.12,12.42 22.9,12.09 22.82,11.71 22.82,6.37 22.75,5.98 22.53,5.66 21.19,4.32 20.87,4.11 20.49,4.03 19.15,4.03 18.97,4.21 18.97,5.83 18.89,5.9 20.2,5.9 20.58,5.98 20.91,6.2 21.84,7.12 22.05,7.45 22.13,7.83 22.13,12.9 22.21,13.28 22.42,13.61 23.96,15.14 24.28,15.36 24.67,15.44 27.47,15.44
GND on Top Layer: 10.1,25.23 73.31,25.23 73.31,-9.81 10.1,-9.81
GND on Bottom Layer: -1.65,24.04 71.97,24.04 71.97,-10.12 -1.65,-10.12
VCC on Bottom Layer: 67.62,11.31 67.62,9.42 67.55,9.35 61.9,9.35 61.41,8.86 60.7,8.86 60.69,8.86 60.32,13.96 60.26,14.16 60.16,14.35 59.98,14.71 59.88,14.8 59.61,15.06 59.61,16.03 59.6,16.05 60.61,16.05 60.81,15.87 60.83,14.88 60.85,14.78 61.08,14.47 61.15,14.08 61.17,13.68 61.33,13.33 62.02,12.63 62.35,12.42 62.73,12.34 63.73,12.34 63.73,11.33 64.02,11.05 65.53,11.05 65.84,11.35 67.58,11.35
VCC on Bottom Layer: 30.76,11.53 31.06,10.83 31.76,10.53 33.22,10.53 33.28,10.59 33.28,13.69 33.36,14.07 33.58,14.4 34.33,15.15 34.66,15.35 35.04,15.41 58.76,15.41 59.14,15.35 59.47,15.15 59.88,14.74 60.54,14.74 60.78,14.98 60.78,15.88 60.57,16.1 31.99,16.1 31.6,15.94 31.29,15.65 31.06,15.42 30.84,15.1 30.76,14.71

## Text on the board
Bottom Silkscreen Layer: BOOT | RESET | CAN终端电阻
Top Silkscreen Layer: KEY

# Board V0.2
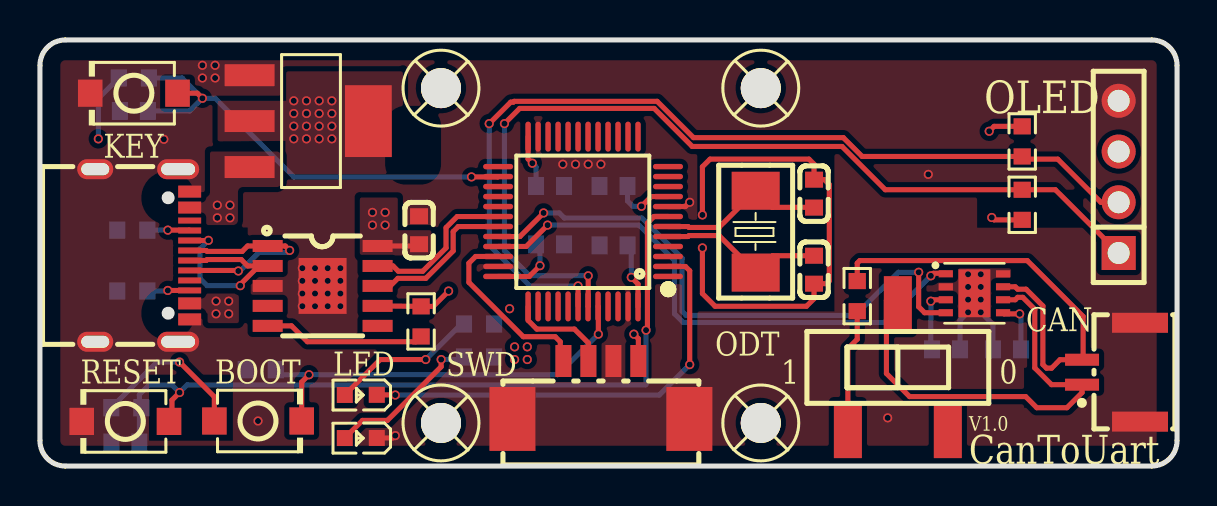
[diagram p3: board, top side]
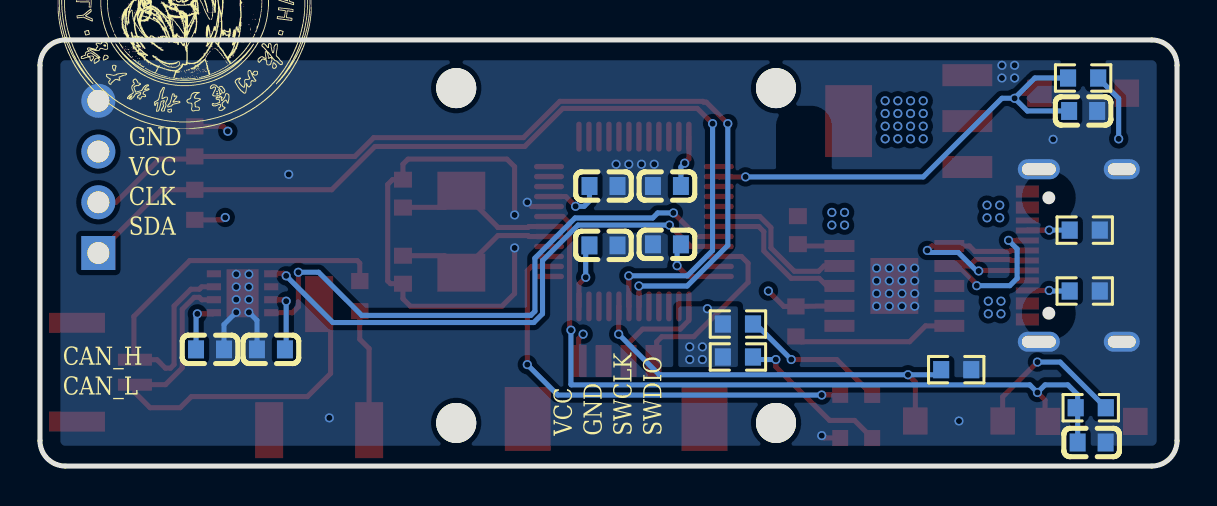
[diagram p4: board, bottom side, seen from below]

Outline 56.9 x 21.34 mm; copper layers: Top Layer, 地层, 电源层, Bottom Layer. Coordinates in mm from the lower left corner of the outline.
Outline path: 0,20.07 0,1.27 arc(0.37,0.37) 1.27,0 55.63,0 arc(56.52,0.37) 56.9,1.27 56.9,20.07 arc(56.52,20.96) 55.63,21.34 1.27,21.34 arc(0.37,20.96) 0,20.07
Stack: Top Layer 0.035mm 外层铜厚1oz / Dielectric1 0.2104mm 7628 RC49% 8.6mil / 地层 0.0152mm 内层铜厚 / Dielectric2 1.065mm 1.1mm H/HOZ Copper / 电源层 0.0152mm 内层铜厚 / Dielectric3 0.2104mm 7628 RC49% 8.6mil / Bottom Layer 0.035mm 外层铜厚1oz

## Design rules (mm)
net OSC_IN: OSC
net OSC_OUT: OSC
net D+: USB
net D-: USB
net CAN_L: CAN
net CAN_H: CAN
template: 自定义配置
spacing copperThickness1oz (default): track to track 0.102, other pairs 0.152 to 0.3
spacing copperThickness2oz: track to track 0.203, other pairs 0.152 to 0.3
track width copperThickness1oz (default): min 0.127, default 0.254, max 2.54
track width copperThickness2oz: min 0.203, default 0.254, max 2.54
differential pair differentialPair (default): width min 0.127, default 0.254, max 2.54; gap min 0.152, default 0.152
via viaSize (default): diameter min 0.406, default 0.457, max 10; hole min 0.3, default 0.305, max 6.3

## Placement (name value [footprint] x y rotation side)
C1  100nF  [C0603]  25.52 14.02 0 bottom
C2  100nF  [C0603]  28.7 11.05 180 bottom
C3  100nF  [C0603]  25.52 11.1 0 bottom
C4  100nF  [C0603]  28.7 14.02 180 bottom
C5  18pF  [C0603]  38.73 9.83 90 top
C6  18pF  [C0603]  38.73 13.64 270 top
C7  0.1uF  [C0603]  4.27 1.18 180 bottom
C9  0.1uF  [C0603]  18.97 11.81 270 top
C10  100nF  [C0603]  45.34 5.84 180 bottom
C11  100nF  [C0603]  48.39 5.84 0 bottom
C12  0.1uF  [C0603]  4.7 17.78 180 bottom
CN1  WAFER-GH1.25-2PWB  [CONN-TH_2P-P1.25_XUNPU_WAFER-GH1.25-2PWB]  53.59 4.7 90 top
H1  2.54-1*4P母  [HDR-TH_4P-P2.54-V-F]  53.97 14.48 90 top
LED  -  [LED_0603]  16 3.56 180 top
POWER_LED  -  [LED_0603]  16 1.4 180 top
R1  10K  [R0603]  4.32 2.92 0 bottom
R2  10K  [R0603]  11.05 4.83 180 bottom
R3  5.1K  [R0603]  4.62 11.81 180 bottom
R4  5.1K  [R0603]  4.62 8.77 180 bottom
R5  10K  [R0603]  19.07 7.24 90 top
R6  120  [R0603]  21.97 5.46 180 bottom
R7  150  [R0603]  21.97 7.11 180 bottom
R8  120  [R0603]  40.89 8.51 270 top
R9  4.7k  [R0603]  49.15 13.08 270 top
R10  4.7K  [R0603]  49.15 16.26 90 top
R11  10K  [R0603]  4.7 19.43 0 bottom
SCREW1  -  [M2螺丝]  20.07 18.92 0 top
SCREW2  -  [M2螺丝]  20.07 2.16 0 top
SCREW3  -  [M2螺丝]  36.07 18.92 0 top
SCREW4  -  [M2螺丝]  36.07 2.16 0 top
SW5  TS-1088-AR02016  [SW-SMD_L3.9-W3.0-P4.45]  4.27 2.23 180 top
SW6  TS-1088-AR02016  [SW-SMD_L3.9-W3.0-P4.45]  10.91 2.26 0 top
SW7  MST-22D18G2 3J  [SW-SMD_SHOUHAN_MST-22D18G23J_C2875122]  42.93 4.95 0 top
SWD  532610471  [CONN-SMD_4P-P1.25_53261-0471]  28.07 3.81 0 top
U1  STM32F103C8T6  [LQFP-48_L7.0-W7.0-P0.50-LS9.0-BL]  27.18 12.24 90 top
U2  AMS1117-3.3  [SOT-223-3_L6.5-W3.4-P2.30-LS7.0-BR]  13.46 17.27 180 top
U3  CH340K  [ESOP-10_L4.9-W3.9-P1.00-LS6.2-BL-EP]  14.14 9.02 270 top
U4  TJA1044GTK/3Z  [HVSON-8_L3.0-W3.0-P0.65-BL-EP]  46.76 8.65 270 top
USB1  TYPE-C16PIN  [USB-C-SMD_TYPE-C16PIN]  5.13 10.54 270 top
USER_KEY  TS-1088-AR02016  [SW-SMD_L3.9-W3.0-P4.45]  4.7 18.67 180 top
X2  8MHz  [CRYSTAL-SMD_L5.0-W3.2]  35.81 11.74 270 top

## Footprints (pads in the part's own frame, mm; a bottom-side part is the same pattern mirrored in y, then rotated)
C0603
  rect 0.8x0.9 smd: 1(-0.7,0) 2(0.7,0)
CONN-SMD_4P-P1.25_53261-0471
  rect 0.8x1.6 smd: 1(-1.875,1.45) 2(-0.625,1.45) 3(0.625,1.45) 4(1.875,1.45)
  rect 2.3x3.2 smd: 5(4.425,-1.45) 6(-4.425,-1.45)
CONN-TH_2P-P1.25_XUNPU_WAFER-GH1.25-2PWB
  rect 0.6x1.7 smd: 1(-0.625,1.45) 2(0.625,1.45)
  rect 1x2.8 smd: 3(-2.475,-1.45) 4(2.475,-1.45)
CRYSTAL-SMD_L5.0-W3.2
  rect 1.9x2.4 smd: 1(-2.05,0) 2(2.05,0)
ESOP-10_L4.9-W3.9-P1.00-LS6.2-BL-EP
  rect 0.6x1.5 smd: 1(-2,-2.75) 2(-1,-2.75) 3(0,-2.75) 4(1,-2.75) 5(2,-2.75) 6(2,2.75) 7(1,2.75) 8(0,2.75) 9(-1,2.75) 10(-2,2.75)
  rect 2.8x2.4 smd: 11(0,0)
HDR-TH_4P-P2.54-V-F
  rect 1.7x1.7 hole 1.1: 1(-3.81,0)
  round 1.7 hole 1.1: 2(-1.27,0) 3(1.27,0) 4(3.81,0)
HVSON-8_L3.0-W3.0-P0.65-BL-EP
  rect 0.355x0.711 smd: 1(-0.975,-1.433) 2(-0.325,-1.433) 3(0.325,-1.433) 4(0.975,-1.433) 5(0.975,1.433) 6(0.325,1.433) 7(-0.325,1.433) 8(-0.975,1.433)
  rect 2.4x1.6 smd: 9(0,0)
LED_0603
  rect 0.8x0.8 smd: 1(-0.851,-0.01) 2(0.75,-0.005)
LQFP-48_L7.0-W7.0-P0.50-LS9.0-BL
  oval 0.27x1.5 smd: 1(-2.75,-4.25) 2(-2.25,-4.25) 3(-1.75,-4.25) 4(-1.25,-4.25) 5(-0.75,-4.25) 6(-0.25,-4.25) 7(0.25,-4.25) 8(0.75,-4.25) 9(1.25,-4.25) 10(1.75,-4.25) 11(2.25,-4.25) 12(2.75,-4.25) 25(2.75,4.25) 26(2.25,4.25) 27(1.75,4.25) 28(1.25,4.25) 29(0.75,4.25) 30(0.25,4.25) 31(-0.25,4.25) 32(-0.75,4.25) 33(-1.25,4.25) 34(-1.75,4.25) 35(-2.25,4.25) 36(-2.75,4.25)
  oval 1.5x0.27 smd: 13(4.25,-2.75) 14(4.25,-2.25) 15(4.25,-1.75) 16(4.25,-1.25) 17(4.25,-0.75) 18(4.25,-0.25) 19(4.25,0.25) 20(4.25,0.75) 21(4.25,1.25) 22(4.25,1.75) 23(4.25,2.25) 24(4.25,2.75) 37(-4.25,2.75) 38(-4.25,2.25) 39(-4.25,1.75) 40(-4.25,1.25) 41(-4.25,0.75) 42(-4.25,0.25) 43(-4.25,-0.25) 44(-4.25,-0.75) 45(-4.25,-1.25) 46(-4.25,-1.75) 47(-4.25,-2.25) 48(-4.25,-2.75)
M2螺丝
  round 2 hole 2: 1(0,0)
R0603
  rect 0.806x0.864 smd: 1(-0.753,0) 2(0.753,0)
SOT-223-3_L6.5-W3.4-P2.30-LS7.0-BR
  rect 2.5x1.1 smd: 1(2.97,-2.3) 2(2.97,0) 3(2.97,2.3)
  rect 2.34x3.6 smd: 4(-2.97,0)
SW-SMD_L3.9-W3.0-P4.45
  rect 1.23x1.36 smd: 1(-2.185,0) 2(2.185,0)
SW-SMD_SHOUHAN_MST-22D18G23J_C2875122
  rect 1.4x2.8 smd: 1(-2.5,-3.155) 2(0,3.155) 3(2.5,-3.155)
USB-C-SMD_TYPE-C16PIN
  oval 1x2.1 hole 0.6x1.7: 1(-4.32,1.788) 2(4.32,1.788)
  oval 1x1.8 hole 0.6x1.4: 3(-4.32,-2.362) 4(4.32,-2.362)
  rect 0.6x1.15 smd: A1B12(-3.2,2.362) A4B9(-2.4,2.362) B1A12(3.2,2.362) B4A9(2.4,2.362)
  rect 0.3x1.15 smd: A5(-1.25,2.362) A6(-0.25,2.362) A7(0.25,2.362) A8(1.25,2.362) B5(1.75,2.362) B6(0.75,2.362) B7(-0.75,2.362) B8(-1.75,2.362)

## Nets
As in the schematic, except:
GND: C1.2 C2.2 C3.2 C4.2 C5.1 C6.1 C7.2 C9.1 C10.1 C11.1 C12.2 CN1.3 CN1.4 H1.4 POWER_LED.1 R2.2 R3.2 R4.2 SW5.2 SWD.3 SWD.5 SWD.6 U1.8 U1.23 U1.35 U1.47 U2.1 U3.3 U3.11 U4.2 U4.8 U4.9 USB1.1 USB1.2 USB1.3 USB1.4 USB1.A1B12 USB1.B1A12 USER_KEY.2

Pads without a net: SCREW1 1; SCREW2 1; SCREW3 1; SCREW4 1; SW7 3; U1 1 3 4 10 11 12 13 14 15 16 17 18 19 20 21 22 25 27 28 29 38 39 40 41 45 46; U3 4 6; USB1 A8 B8

## Via types
v1: diameter 0.457, hole 0.305, Top Layer to Bottom Layer, 109 vias

## Routing (per net, layer and track width the routed paths; a pad name or vN(x,y) marks a point on that pad's centre or on a via; arc(x,y) is an arc through that point)
+5V: length 38.9
  Top Layer w0.254: 45.33,8.33 44.65,8.33 v1(44.58,8.26)
  电源层 w0.254: v1(9.44,7.62) 9.75,7.31 43,7.31 43.94,8.26 v1(44.58,8.26)
  Bottom Layer w0.254: C10.2 44.58,5.9 v1(44.58,8.26)
  vias: v1(8.81,8.26) v1(8.81,7.62) v1(8.87,13.06) v1(8.87,12.43) v1(9.44,8.26) v1(9.51,13.06) v1(9.51,12.43)
GND: length 30.9
  Top Layer w0.254: v1(33.15,10.92) 33.15,8.64 33.78,8 38.35,8 38.73,8.38 C5.1 39.36,9.13 39.5,9.27 39.5,14.1 39.25,14.34 C6.1 38.73,15.12 38.48,15.37 33.53,15.37 33.15,14.99 v1(33.15,12.57) ; U1.8 32.3,12.99 v1(32.51,13.21) ; POWER_LED.1 17.66,1.41 v1(17.78,1.52)
  Bottom Layer w0.254: C11.1 47.69,7.09 v1(47.08,7.7) ; C10.1 46.04,7.3 v1(46.44,7.7)
  vias: v1(6.2,16.36) v1(8.13,20.07) v1(8.13,19.43) v1(8.76,20.07) v1(8.76,19.43) v1(10.91,2.26) v1(13.13,9.91) v1(13.13,9.27) v1(13.13,8.64) v1(13.13,8) v1(13.76,9.91) v1(13.76,9.27) v1(13.76,8.64) v1(13.76,8) v1(14.4,9.91) v1(14.4,9.27) v1(14.4,8.64) v1(14.4,8) v1(15.03,9.91) v1(15.03,9.27) v1(15.03,8.64) v1(15.03,8) v1(26.16,15.11) v1(26.8,15.11) v1(27.43,15.11) v1(28.07,15.11) v1(42.42,2.41) v1(44.45,14.61) v1(46.44,9.6) v1(46.44,8.97) v1(46.44,8.33) v1(47.08,9.6) v1(47.08,8.97) v1(47.08,8.33)
VCC: length 37.4
  Top Layer w0.254: C9.2 18.88,11.02 U3.10 ; v1(47.62,12.45) 47.74,12.33 R9.2 ; v1(29.72,6.6) 29.94,6.38 SWD.4 ; v1(6.98,5.21) 8.73,3.47 SW6.1 ; v1(30.1,13.01) 30.58,13.49 U1.9 ; U1.48 29.93,9.11 v1(29.59,9.45) ; v1(24.64,15.17) 24.43,15.38 U1.24 ; v1(25.02,10.03) 24.48,9.49 U1.36 ; v1(20.45,8.76) 19.68,8 R5.2 U3.7 ; v1(47.5,16.76) 47.74,17.01 R10.2 ; U4.5 48.25,7.62 v1(49.02,7.62)
  Bottom Layer w0.254: v1(24.64,15.17) 24.82,14.98 C1.1 ; v1(29.59,9.45) 29.59,10.86 C2.1 ; R11.1 2.92,18.41 v1(2.92,16.38) ; C4.1 29.4,13.27 29.67,13.01 v1(30.1,13.01) ; R1.1 5.85,5.21 v1(6.98,5.21) ; C11.2 49.09,7.56 v1(49.02,7.62) ; v1(25.02,10.03) 25.02,10.91 C3.1
  vias: v1(12.7,18.29) v1(12.7,17.65) v1(12.7,17.02) v1(12.7,16.38) v1(13.34,18.29) v1(13.34,17.65) v1(13.34,17.02) v1(13.34,16.38) v1(13.97,18.29) v1(13.97,17.65) v1(13.97,17.02) v1(13.97,16.38) v1(14.6,18.29) v1(14.6,17.65) v1(14.6,17.02) v1(14.6,16.38) v1(16.64,12.7) v1(16.64,12.06) v1(17.27,12.7) v1(17.27,12.06) v1(23.5,7.88) v1(23.75,5.97) v1(23.75,5.33) v1(24.38,5.97) v1(24.38,5.33)
BOOT0: length 20.9
  Top Layer w0.254: v1(13.46,4.57) 13.1,4.21 SW6.2 ; U1.44 27.94,7.98 v1(27.94,6.6)
  Bottom Layer w0.254: R2.1 12.06,4.57 v1(13.46,4.57) 25.91,4.57 v1(27.94,6.6)
CAN_H: length 23.1
  Top Layer w0.254: U4.7 48.8,8.98 48.92,8.85 49.34,8.85 50.18,8.01 50.18,5.08 50.36,4.9 50.62,4.9 51.04,5.32 CN1.2 52.2,5.38 52.2,7.49 49.4,10.29 41.02,10.29 40.89,10.16 R8.1
CAN_L: length 23.2
  Top Layer w0.254: 48.19,8.33 48.8,8.33 48.92,8.45 49.18,8.45 49.78,7.85 49.78,4.91 50.62,4.07 CN1.1 52.14,3.68 51.39,2.92 49.88,2.92 49.32,3.48 43.51,3.48 42.35,4.64 42.35,8.3 42.48,8.43 42.61,8.43 SW7.2
CAN_RX: length 29.3
  Top Layer w0.254: v1(43.97,9.7) 43.97,7.98 44.27,7.68 U4.4 ; v1(25.2,12.67) 24.02,11.49 U1.32
  Bottom Layer w0.254: v1(43.97,9.7) 42.95,9.7 40.79,7.54 32.34,7.54 32.13,7.75 32.13,10.41 30.12,12.42 26.24,12.42 25.98,12.67 v1(25.2,12.67)
CAN_TX: length 27.5
  Top Layer w0.254: U1.33 24.33,10.99 v1(25.4,12.06) ; U4.1 45.3,9.65 44.7,9.65 v1(44.58,9.53)
  Bottom Layer w0.254: v1(25.4,12.06) 29.97,12.06 31.75,10.29 31.75,7.62 32.19,7.19 42.24,7.19 v1(44.58,9.53)
CC1: length 2.1
  Top Layer w0.254: USB1.A5 7.47,11.81 v1(6.4,11.81)
  Bottom Layer w0.254: v1(6.4,11.81) R3.1
CC2: length 2.1
  Top Layer w0.254: USB1.B5 v1(6.4,8.79)
  Bottom Layer w0.254: v1(6.4,8.79) 6.37,8.77 R4.1
D+: length 10.7
  Top Layer w0.254: USB1.A6 8.32,10.79 8.37,10.75 10.12,10.75 10.39,11.02 U3.1 12.27,11.02 v1(12.49,10.8) ; USB1.B6 9.9,9.79 v1(9.93,9.77)
  Bottom Layer w0.254: v1(12.49,10.8) 12.39,10.7 10.95,10.7 10.02,9.77 v1(9.93,9.77)
D-: length 10.6
  Top Layer w0.254: v1(10.02,9.03) 10.02,9.09 10.95,10.02 ; 10.95,10.02 10.39,10.02 10.07,10.34 8.37,10.34 8.32,10.29 USB1.A7 ; 10.95,10.02 U3.2 ; v1(8.43,11.3) 8.42,11.29 USB1.B7
  Bottom Layer w0.254: v1(10.02,9.03) 8.37,9.03 8,9.4 8,10.87 v1(8.43,11.3)
I2C_CLK: length 46.5
  Top Layer w0.254: 26.93,9.02 U1.42 ; v1(22.48,17.15) 23.56,18.22 23.69,18.22 23.73,18.26 30.88,18.26 32.7,16.44 40.2,16.44 41.14,15.5 R10.1 49.28,15.37 50.93,15.37 53.09,13.21 H1.2
  Bottom Layer w0.254: v1(26.92,9.02) 24.51,9.02 22.48,11.05 v1(22.48,17.15)
I2C_SDA: length 46.7
  Top Layer w0.254: v1(27.43,9.53) 27.43,8 U1.43 ; v1(23.24,17.15) 24,17.91 30.73,17.91 32.64,16 40.13,16 42.3,13.83 R9.1 50.81,13.83 H1.1
  Bottom Layer w0.254: v1(23.24,17.15) 23.24,10.79 24.51,9.53 v1(27.43,9.53)
KEY: length 23.9
  Top Layer w0.254: USER_KEY.1 7.87,18.67 v1(8.13,18.42) ; U1.26 22.91,14.48 v1(21.59,14.48)
  Bottom Layer w0.254: v1(8.13,18.42) 7.49,17.78 C12.1 ; v1(8.13,18.42) 7.11,19.43 R11.2 ; v1(8.13,18.42) 8.76,18.42 12.7,14.48 v1(21.59,14.48)
LED_G: length 22.2
  Top Layer w0.254: v1(32.51,5.08) 32.51,9.78 32.3,9.99 U1.2 ; v1(17.78,3.56) 17.77,3.57 16.85,3.57
  Bottom Layer w0.254: v1(32.51,5.08) 30.99,3.56 v1(17.78,3.56)
OSC_IN: length 8.5
  Top Layer w0.254: U1.5 32.43,11.49 32.48,11.54 33.98,11.54 35.81,9.71 X2.2 36.66,10.53 C5.2
OSC_OUT: length 8.4
  Top Layer w0.254: C6.2 38.72,12.95 36.64,12.95 X2.1 33.98,11.95 33.98,11.95 32.48,11.95 32.43,11.99 U1.6
RESET: length 39.2
  Top Layer w0.254: SW5.1 6.6,2.38 6.6,3.3 v1(6.98,3.68) ; U1.7 31.42,12.5 30.73,12.5 30.4,12.17 30.4,6.87 v1(30.33,6.81)
  Bottom Layer w0.254: v1(30.33,6.81) 30.33,4.09 30.3,4.06 7.37,4.06 v1(6.98,3.68) 6.6,4.06 5.46,4.06 4.97,3.58 C7.1
SWCLK: length 5.1
  Top Layer w0.254: U1.37 24.43,7.29 24.86,6.86 26.74,6.86 27.44,6.16 SWD.2
SWDIO: length 9.4
  Top Layer w0.254: U1.34 21.8,10.49 21.46,10.16 21.46,9.2 24.18,6.48 25.78,6.48 26.03,6.22 26.03,5.42 SWD.1
UART1_RX: length 7.8
  Top Layer w0.254: U1.31 20.93,11.99 20.68,11.74 20.68,10.77 19.3,9.4 17.91,9.4 17.53,9.02 U3.8
UART1_TX: length 7.9
  Top Layer w0.254: U3.9 17.67,10.02 17.93,9.75 19.15,9.75 20.32,10.92 20.32,11.94 20.88,12.49 U1.30
$1N4391: length 8.1
  Top Layer w0.254: R5.1 18.81,6.23 13.38,6.23 12.59,7.02 U3.5
$1N4645: length 7.9
  Top Layer w0.254: v1(20.07,5.33) 20.07,4.98 17.39,2.29 16.14,2.29 POWER_LED.2
  Bottom Layer w0.254: v1(20.07,5.33) 21.09,5.33 R6.2
$1N4695: length 7.4
  Top Layer w0.254: LED.2 17.03,5.33 v1(19.3,5.33)
  Bottom Layer w0.254: v1(19.3,5.33) 21.08,7.11 R7.2
$1N5635: length 6.2
  Top Layer w0.254: SW7.1 40.43,5.88 40.89,6.35 R8.2

## Copper pours and planes (outline as drawn; the poured copper is in the pictures)
+5V on Top Layer: 6.86,12.7 6.93,12.52 7.11,12.45 8.13,12.45 8.13,12.06 9.65,12.06 9.83,12.14 9.91,12.32 9.91,13.72 9.98,13.9 10.16,13.97 11.84,13.97 12.02,14.04 12.09,14.22 12.09,15.5 12.02,15.68 11.84,15.75 8.51,15.75 8.51,15.75 8.51,13.72 8.43,13.54 8.25,13.46 6.86,13.46 6.86,13.46
+5V on 电源层: 8.43,7.14 8.43,13.46 10.05,13.46 10.05,7.12 10.03,7.11 8.46,7.11
GND on Top Layer: 62.61,29.46 62.36,29.21 -4.32,29.21 -4.32,-7.75 -5.46,-8.89 -2.29,-12.06 63.5,-12.06 62.61,-11.18
GND on Bottom Layer: 73.15,22.48 -10.03,22.48 -11.05,21.46 -11.05,-5.46 -8.25,-2.67 70.49,-2.67 73.15,0
GND on 地层: 1.02,20.32 55.88,20.32 55.88,1.02 1.02,1.02
VCC on Top Layer: 8.89,18.29 12.32,18.29 12.32,19.77 18.12,19.77 18.16,19.81 18.16,14.73 18.03,14.61 12.28,14.61 12.28,16.28 8.89,16.26
VCC on Top Layer: 16,10.54 19.59,10.54 19.59,11.81 17.91,11.81 17.91,13.45 16.01,13.45 16,13.46
VCC on Bottom Layer: 21.97,4.78 23.58,4.78 23.62,4.83 24.96,4.83 24.96,7.96 24.93,7.99 21.97,7.99
VCC on 电源层: -9.91,25.53 59.69,25.53 64.52,20.7 64.52,-5.08 64.01,-5.59 -6.35,-5.59 -9.91,-2.03
+5V on Top Layer: 6.78,8.59 6.79,8.62 6.83,8.64 9.9,8.64 9.94,8.62 9.95,8.59 9.95,7.21 9.94,7.17 9.9,7.15 8.44,7.15 8.41,7.17 8.39,7.21 8.39,7.6 8.38,7.64 8.34,7.65 6.83,7.65 6.79,7.67 6.78,7.7 6.78,8.51

## Text on the board
Bottom Silkscreen Layer: VCC / GND / SWCLK / SWDIO | GND / VCC / CLK / SDA | CAN_H / CAN_L
Top Silkscreen Layer: RESET | KEY | BOOT | LED | SWD | ODT | 1 | 0 | CAN | OLED | V1.0 | CanToUart
